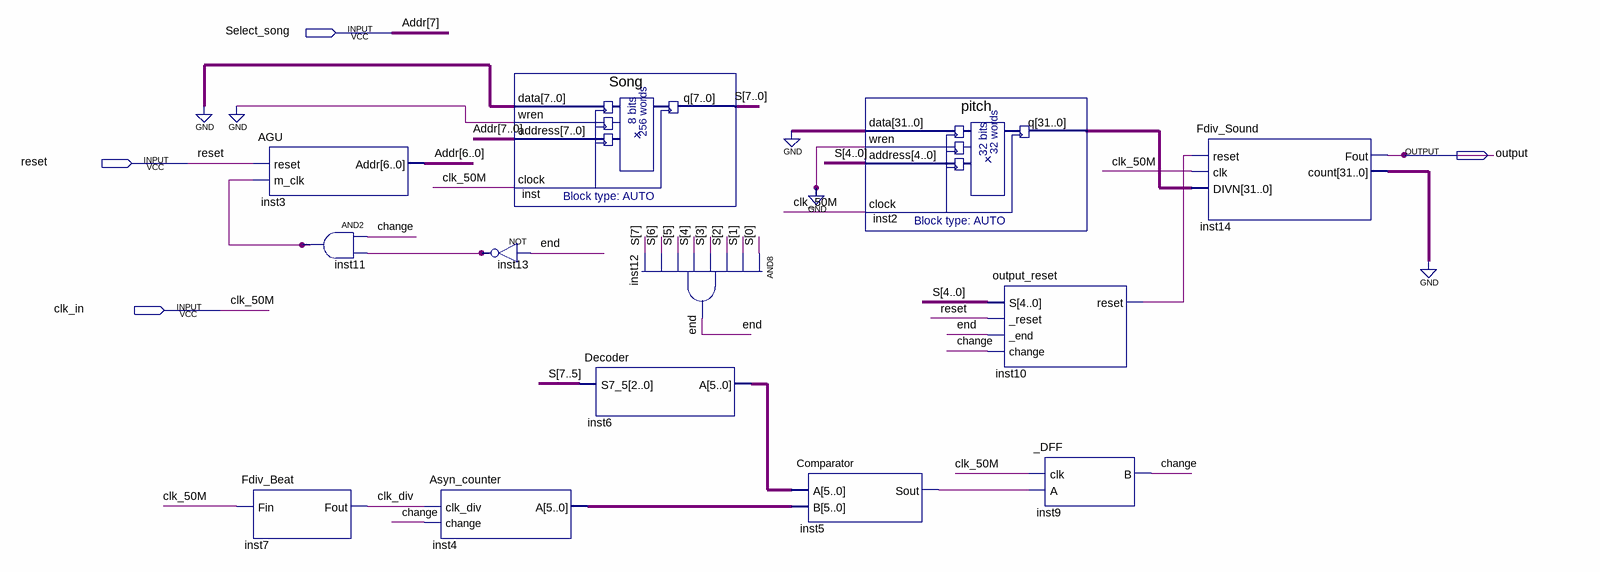
[diagram p0: schematic sheet]
// Quartus schematic hw3.bdf as structural Verilog: 13 symbols, 4 pins
module hw3 (
  input  Select_song,
  input  reset,
  input  clk_in,
  output \output 
);

  wire change, clk_div, \end , inst5_sout, inst10_reset, inst11_out, inst13_out;
  wire [5:0] inst4_a, inst6_a;
  wire [6:0] Addr;
  wire [7:0] S;
  wire [31:0] inst2_q, inst14_count;

  AGU inst3 (.reset(reset), .m_clk(inst11_out), .Addr(Addr));
  Fdiv_Beat inst7 (.Fin(clk_in), .Fout(clk_div));
  and inst11 (inst11_out, change, inst13_out);
  Asyn_counter inst4 (.clk_div(clk_div), .change(change), .A(inst4_a));
  Song inst (.data({8{1'b0}}), .wren(1'b0), .address({Select_song, Addr}), .clock(clk_in), .q(S));
  not inst13 (inst13_out, \end );
  Decoder inst6 (.S7_5(S[7:5]), .A(inst6_a));
  and inst12 (\end , S[0], S[1], S[2], S[3], S[4], S[5], S[6], S[7]);
  Comparator inst5 (.A(inst6_a), .B(inst4_a), .Sout(inst5_sout));
  pitch inst2 (.data({32{1'b0}}), .wren(1'b0), .address(S[4:0]), .clock(clk_in), .q(inst2_q));
  output_reset inst10 (.S(S[4:0]), ._reset(reset), ._end(\end ), .change(change), .reset(inst10_reset));
  _DFF inst9 (.clk(clk_in), .A(inst5_sout), .B(change));
  Fdiv_Sound inst14 (.reset(inst10_reset), .clk(clk_in), .DIVN(inst2_q), .Fout(\output ), .count(inst14_count));
  // also tied to GND on the sheet: {inst14_count[0], inst14_count[1], inst14_count[2], inst14_count[3], inst14_count[4], inst14_count[5], inst14_count[6], inst14_count[7], inst14_count[8], inst14_count[9], inst14_count[10], inst14_count[11], inst14_count[12], inst14_count[13], inst14_count[14], inst14_count[15], inst14_count[16], inst14_count[17], inst14_count[18], inst14_count[19], inst14_count[20], inst14_count[21], inst14_count[22], inst14_count[23], inst14_count[24], inst14_count[25], inst14_count[26], inst14_count[27], inst14_count[28], inst14_count[29], inst14_count[30], inst14_count[31]}

  // Other names for the same wires on the sheet: Addr[7] = Select_song; clk_50M = clk_in
endmodule
